# EAGLE design rfid_accessctl (EAGLE 7.5.0)
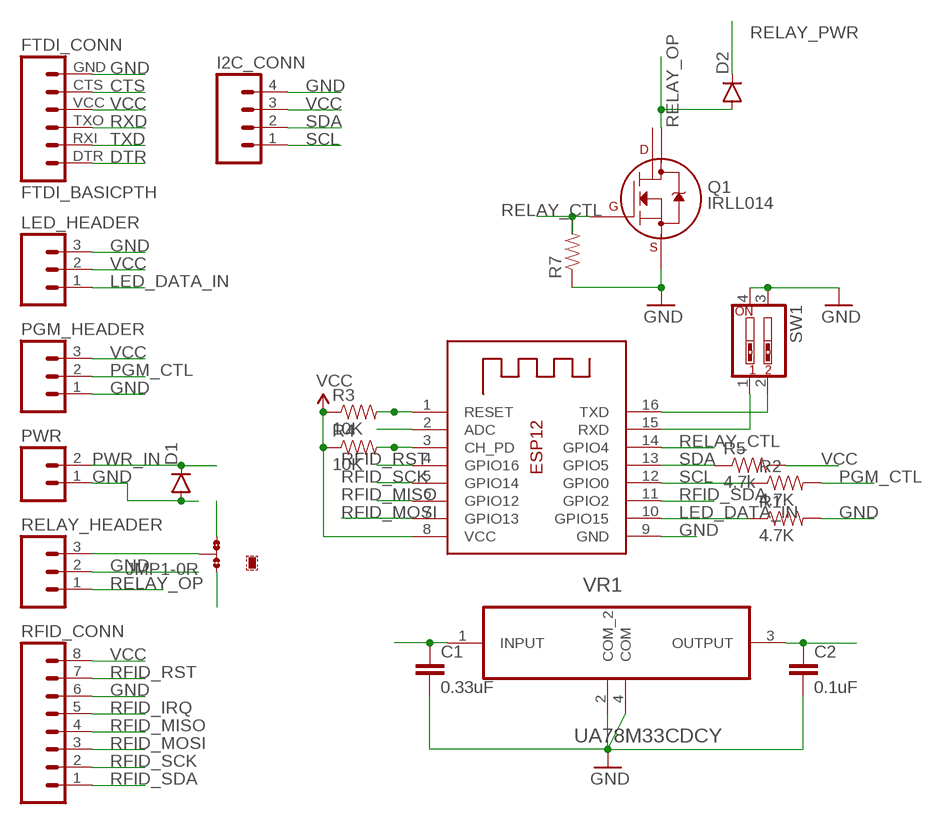
[diagram p0: schematic, sheet 1]

## Parts
C1  0.33uF  CAP0805  [0805]
C2  0.1uF  CAP0805  [0805]
D1  DIODESMA  [SMA-DIODE]
D2  DIODESMA  [SMA-DIODE]
FTDI_CONN  FTDI_BASICPTH  [FTDI_BASIC]
I2C_CONN  M04PTH  [1X04]
JMP1  0R-JUMPB  [B0R-JMP]
LED_HEADER  M03PTH  [1X03]
PGM_HEADER  M03PTH  [1X03]
PWR  M02PTH  [1X02]
Q1  IRLL014  [SOT-223]
R1  4.7K  10KOHM-1/10W-1%(0603)0603  [0603-RES]
R2  4.7K  10KOHM-1/10W-1%(0603)0603  [0603-RES]
R3  10K  10KOHM-1/10W-1%(0603)0603  [0603-RES]
R4  10K  10KOHM-1/10W-1%(0603)0603  [0603-RES]
R5  4.7k  470OHM1/10W1%(0603)  [0603-RES]
R7  RESISTOR0603-RES  [0603-RES]
RELAY_HEADER  M03PTH  [1X03]
RFID_CONN  M08  [1X08_ROUND]
SW1  SW_DIP-2-SMT-HALFSIZE  [DIPSWITCH-02-50MIL]
VR1  UA78M33CDCY  [SOT230P700X180-4N]
X1  ESP-12  [ESP-12]

## Nets
CTS: FTDI_CONN.CTS
DTR: FTDI_CONN.DTR
GND: C1.2 C2.2 D1.A FTDI_CONN.GND I2C_CONN.4 LED_HEADER.3 PGM_HEADER.1 PWR.1 Q1.3(S) R1.2 R7.1 RELAY_HEADER.2 RFID_CONN.6 SW1.3 SW1.4 VR1.2(COM_2) VR1.4(COM) X1.9(GND)
LED_DATA_IN: LED_HEADER.1 R1.1 X1.10(GPIO15)
N$1: R3.2 X1.1(RESET)
N$2: X1.2(ADC)
N$8: R4.2 X1.3(CH_PD)
PGM_CTL: PGM_HEADER.2 R2.2
PWR_IN: C1.1 D1.C JMP1.3 PWR.2 VR1.1(INPUT)
RELAY_CTL: Q1.1(G) R7.2 X1.14(GPIO4)
RELAY_OP: D2.A Q1.2(D1) RELAY_HEADER.1
RELAY_PWR: D2.C JMP1.2 RELAY_HEADER.3
RFID_IRQ: RFID_CONN.5
RFID_MISO: RFID_CONN.4 X1.6(GPIO12)
RFID_MOSI: RFID_CONN.3 X1.7(GPIO13)
RFID_RST: RFID_CONN.7 X1.4(GPIO16)
RFID_SCK: RFID_CONN.2 X1.5(GPIO14)
RFID_SDA: RFID_CONN.1 X1.11(GPIO2)
RXD: FTDI_CONN.TXO SW1.1 X1.15(RXD)
SCL: I2C_CONN.1 R2.1 X1.12(GPIO0)
SDA: I2C_CONN.2 R5.1 X1.13(GPIO5)
TXD: FTDI_CONN.RXI SW1.2 X1.16(TXD)
VCC: C2.1 FTDI_CONN.VCC I2C_CONN.3 JMP1.1 LED_HEADER.2 PGM_HEADER.3 R3.1 R4.1 R5.2 RFID_CONN.8 VR1.3(OUTPUT) X1.8(VCC)
Unconnected: Q1.4(D2)

## Library data of the parts
C1 C2 = SparkFun-Capacitors:CAP: Capacitor Standard 0603 ceramic capacitor, and 0.1" leaded capacitor.
D1 D2 = SparkFun-DiscreteSemi:DIODE: Diode These are standard reverse protection diodes and small signal diodes. SMA package can handle up to about 1A. SOD-323 can handle about 200mA. What the SOD-323 package when ordering, there are some mfgs out there that are 5-pin packages.
FTDI_CONN = SparkFun-Connectors:FTDI_BASIC: FTDI Basic header with labels
I2C_CONN = SparkFun-Connectors:M04: Header 4 Standard 4-pin 0.1" header. Use with straight break away headers (SKU : PRT-00116), right angle break away headers (PRT-00553), swiss pins (PRT-00743), machine pins (PRT-00117), and female headers (PRT-00115). Molex polarized connector foot print use with SKU : PRT-08231 with associated crimp pins and housings. 1MM SMD Version SKU: PRT-10208
JMP1 = jump-0r-smd:0R-JUMP: SMD 0R 0805 Jumper
LED_HEADER PGM_HEADER RELAY_HEADER = SparkFun-Connectors:M03: Header 3 Standard 3-pin 0.1" header. Use with straight break away headers (SKU : PRT-00116), right angle break away headers (PRT-00553), swiss pins (PRT-00743), machine pins (PRT-00117), and female headers (PRT-00115). Molex polarized connector foot print use with SKU : PRT-08232 with associated crimp pins and housings.
PWR = SparkFun-Connectors:M02: Standard 2-pin 0.1" header. Use with - straight break away headers ( PRT-00116) - right angle break away headers (PRT-00553) - swiss pins (PRT-00743) - machine pins (PRT-00117) - female headers (PRT-00115) Molex polarized connector foot print use with: PRT-08233 with associated crimp pins and housings. 2.54_SCREWTERM for use with PRT-10571. 3.5mm Screw Terminal footprints for PRT-08084 5mm Screw Terminal footprints for use with PRT-08432
Q1 = Misc_Transistors:IRLL*: International Rectifier IRLL series N-channel enhancement mode MOSFET HEXFET Power MOSFET SOT-223 Includes body diode
R1 R2 = SparkFun-Resistors:10KOHM-1/10W-1%(0603): RES-00824; PROD_ID: RES-00824; VALUE: 10K
R3 R4 = SparkFun-Resistors:10KOHM-1/10W-1%(0603): RES-00824; PROD_ID: RES-00824
R5 = SparkFun-Resistors:470OHM1/10W1%(0603): RES-07869; PROD_ID: RES-07869; VALUE: 470
R7 = SparkFun-Passives:RESISTOR: Resistor Basic schematic elements and footprints for 0603, 1206, and PTH resistors.
RFID_CONN = SparkFun-Connectors:M08: Header 8 Standard 8-pin 0.1" header. Use with straight break away headers (SKU : PRT-00116), right angle break away headers (PRT-00553), swiss pins (PRT-00743), machine pins (PRT-00117), and female headers (PRT-00115).
SW1 = SparkFun-Electromechanical:SW_DIP-2: DIP SWITCH
VR1 = TI-UA78M33CDCY:UA78M33CDCY: IC, LINEAR VOLT REGULATOR, 3.3V, SOT-223-4; MPN: UA78M33CDCY; OC_FARNELL: 2296031; OC_NEWARK: 03P0895; PACKAGE: SOT-223-4; SUPPLIER: TEXAS INSTRUMENTS
X1 = adafruit:ESP-12

## Board
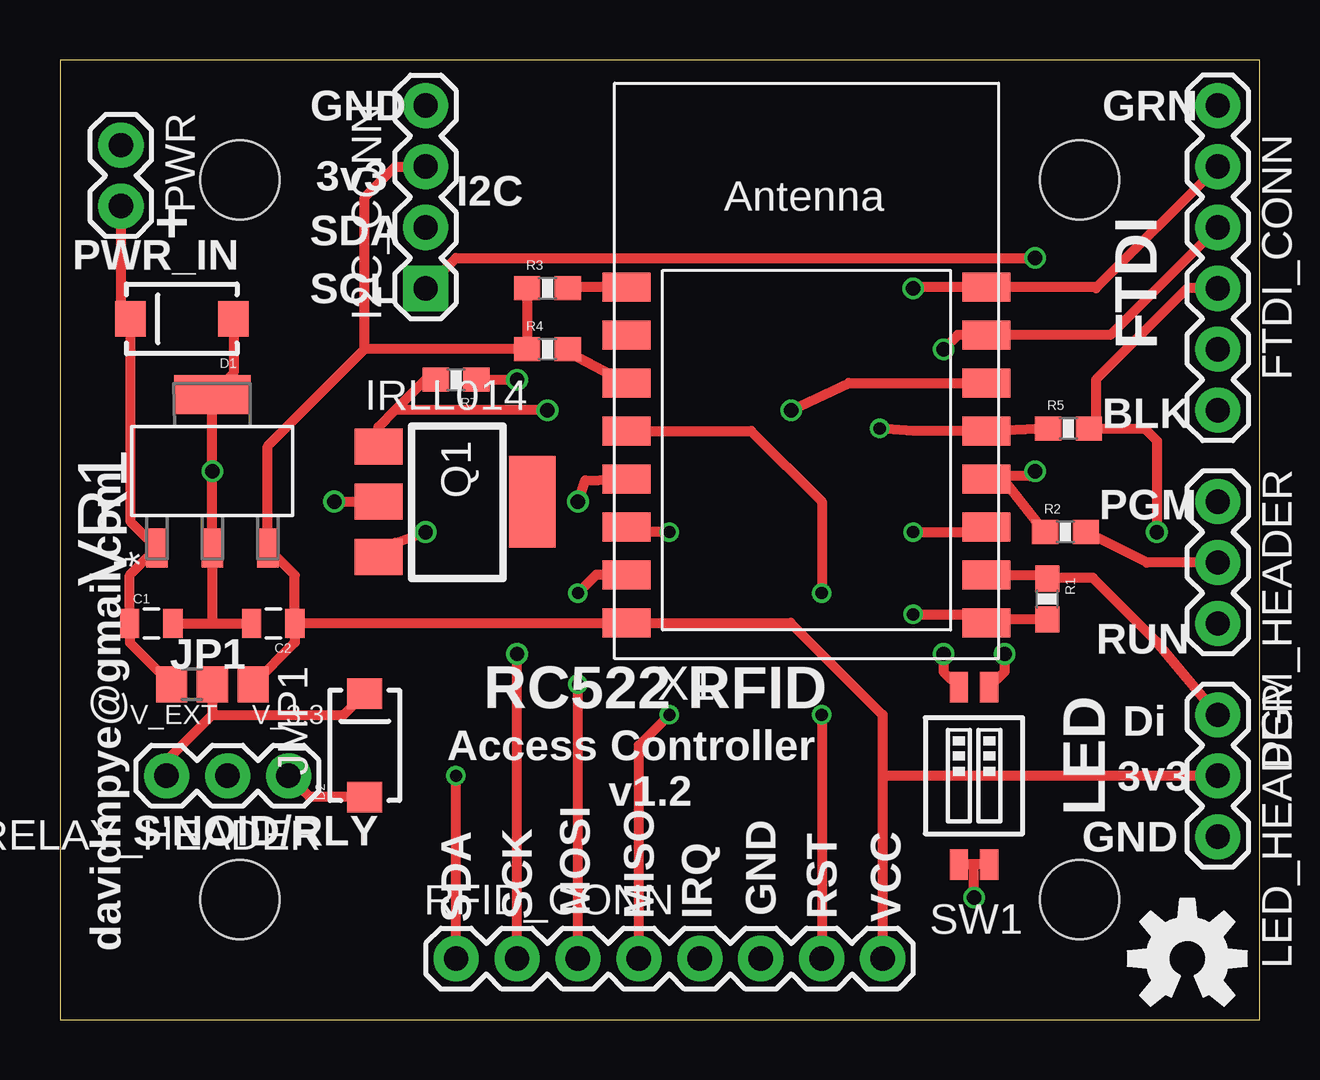
[diagram p1: board, top side]
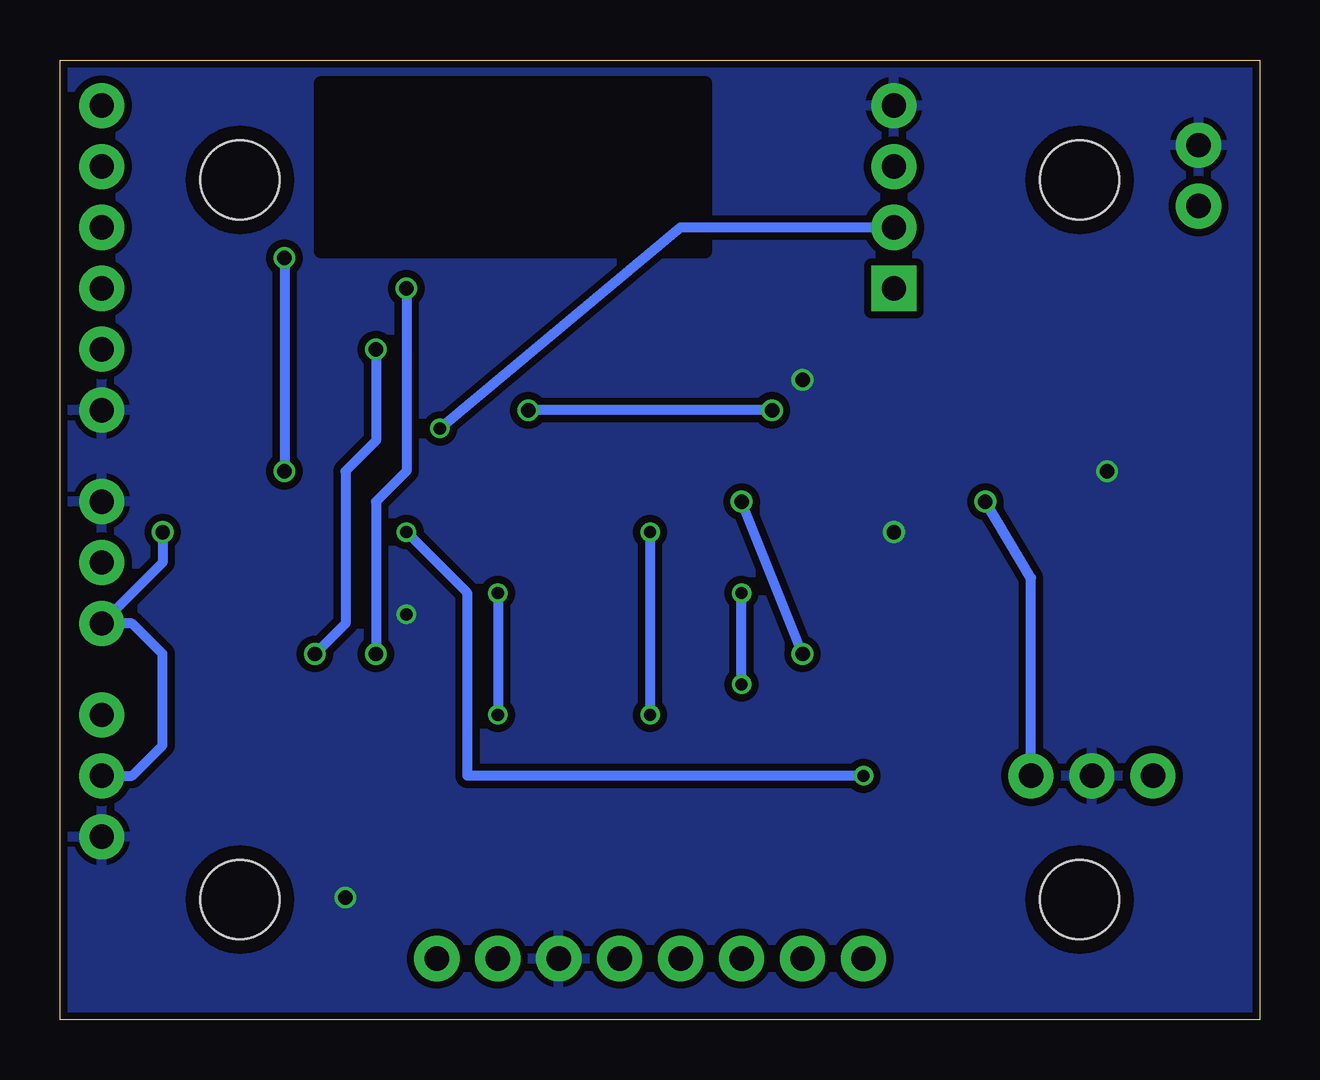
[diagram p2: board, bottom side, seen from below]

Size 50 x 40 mm. Coordinates in mm from the lower left corner, seen from the top.
Outline: 0,0 50,0 50,40 0,40 0,0
Copper layers (1*16): Top 0.035mm / dielectric 1.5mm / Bottom 0.035mm
Design rules "dirt_cheap_dirty_boards.v1": minimum track width 5mil, minimum drill 12mil, track to track 5mil, track to pad 5mil, pad to pad 5mil, via to via 5mil, smd to smd 0mil, copper to edge 10mil, drill to drill 10mil, minimum pad ring 10mil, minimum via ring 6mil, stop-mask expansion 2mil, vias tented up to drill 25mil, thermal gap 10mil

### Footprints (pad centres in the part's own frame; a part is rotated, then mirrored left to right if it is on the bottom)
0805 = smd 0.8 x 1.2: 1 -0.9,0; 2 0.9,0
SMA-DIODE = smd 1.27 x 1.47: A -2.15,0; C 2.15,0
FTDI_BASIC = drill 1.016 pad 1.88: CTS 10.16,0; DTR 0,0; GND 12.7,0; RXI 2.54,0; TXO 5.08,0; VCC 7.62,0
1X04 = drill 1.016 pad 1.88 square: 1 0,0 | drill 1.016 pad 1.88: 2 2.54,0; 3 5.08,0; 4 7.62,0
B0R-JMP = smd 1.5 x 1.3: 1 0,1.7; 2 0,0; 3 0,-1.7
1X03 = drill 1.016 pad 1.88: 1 0,0; 2 2.54,0; 3 5.08,0
1X02 = drill 1.016 pad 1.88: 1 0,0; 2 2.54,0
SOT-223 = smd 1.499 x 2.007: 1 -2.3,-3.235; 2 0,-3.235; 3 2.3,-3.235 | smd 3.81 x 1.93: 4 0,3.175
0603-RES = smd 1.1 x 1: 1 -0.85,0; 2 0.85,0
1X08_ROUND = drill 1.016 pad 1.88: 1 0,0; 2 2.54,0; 3 5.08,0; 4 7.62,0; 5 10.16,0; 6 12.7,0; 7 15.24,0; 8 17.78,0
DIPSWITCH-02-50MIL = smd 0.762 x 1.27: 1 -0.635,-3.7; 2 0.635,-3.7; 3 0.635,3.7; 4 -0.635,3.7
STAND-OFF = hole 3.302: 0,0
SOT230P700X180-4N = smd 1.626 x 0.889: 1 -3.2,2.311; 2 -3.2,0; 3 -3.2,-2.311 | smd 1.626 x 3.175: 4 3.2,0
ESP-12 = smd 2 x 1.2: 1 -7.5,4.5; 2 -7.5,2.5; 3 -7.5,0.5; 4 -7.5,-1.5; 5 -7.5,-3.5; 6 -7.5,-5.5; 7 -7.5,-7.5; 8 -7.5,-9.5; 9 7.5,-9.5; 10 7.5,-7.5; 11 7.5,-5.5; 12 7.5,-3.5; 13 7.5,-1.5; 14 7.5,0.5; 15 7.5,2.5; 16 7.5,4.5

### Placement (x,y rotation side)
C1  3.81,16.51 0 top
C2  8.89,16.51 180 top
D1  5.08,29.21 180 top
D2  12.7,11.43 90 top
FTDI_CONN  48.26,38.1 270 top
I2C_CONN  15.24,30.48 90 top
JMP1  6.35,13.97 270 top
LED_HEADER  48.26,12.7 270 top
PGM_HEADER  48.26,21.59 270 top
PWR  2.54,36.45 270 top
Q1  16.51,21.59 270 top
R1  41.15,17.53 270 top
R2  41.91,20.32 0 top
R3  20.32,30.48 0 top
R4  20.32,27.94 0 top
R5  42.04,24.64 0 top
R7  16.51,26.67 180 top
RELAY_HEADER  9.53,10.16 180 top
RFID_CONN  16.51,2.54 0 top
SW1  38.1,10.16 180 top
U$2  [STAND-OFF]  42.5,5 0 top
U$3  [STAND-OFF]  7.5,5 0 top
U$4  [STAND-OFF]  42.5,35 0 top
U$5  [STAND-OFF]  7.5,35 0 top
U$6  [OSHW-LOGO-M]  46.99,2.54 0 top
VR1  6.35,22.86 90 top
X1  31.11,26.04 0 top

### Tracks (layer width: path | path; a pad name or v marks a point on that pad's centre or on a via)
GND  (via drill 0.51, 0.6)
  Top 0.406: v35.56,16.89 38.1,16.89 | 38.1,16.89 38.26,16.89 X1.9 | R1.2 38.31,16.68 38.1,16.89 | Q1.3 13.97,19.86 v15.24,20.32 | C1.2 6.35,16.51 | 6.35,16.51 C2.2 | 6.35,16.51 VR1.2 v6.35,22.86 VR1.4 7.23,26.94 D1.A | R7.1 v19.05,26.67 | SW1.4 38.1,6.46 | 38.1,6.46 SW1.3 | v38.1,5.08 38.1,6.46
  pour Bottom (isolate 0.305): 0,40 50,40 50,0 0,0
LED_DATA_IN
  Top 0.406: X1.10 40.99,18.54 R1.1 41.19,18.41 43.05,18.41 45.72,15.75 LED_HEADER.1
N$1
  Top 0.406: X1.1 21.23,30.54 R3.2
N$8
  Top 0.406: X1.3 20.94,27.94 R4.2
PGM_CTL
  Top 0.406: PGM_HEADER.2 45.3,19.05 R2.2
PWR_IN
  Top 0.406: JMP1.3 2.91,15.71 C1.1 2.91,18.53 VR1.1 2.93,20.77 D1.C 2.54,29.6 PWR.2
RELAY_CTL  (via drill 0.6)
  Top 0.406: v30.48,25.4 32.88,26.54 X1.14 | v20.32,25.4 13.97,25.4 | 13.97,25.4 13.28,24.7 Q1.1 | R7.2 15.24,26.67 13.97,25.4
  Bottom 0.406: v20.32,25.4 v30.48,25.4
RELAY_OP  (via drill 0.6)
  Top 0.406: v11.43,21.59 Q1.2 | D2.A 10.4,9.28 RELAY_HEADER.1
  Bottom 0.406: RELAY_HEADER.1 9.53,18.41 v11.43,21.59
RELAY_PWR
  Top 0.406: JMP1.2 6.35,12.7 | 6.35,12.7 4.45,10.79 RELAY_HEADER.3 | 6.35,12.7 11.82,12.7 D2.C
RFID_MISO  (via drill 0.51)
  Top 0.406: v25.4,20.32 23.4,20.32 X1.6 | RFID_CONN.4 24.13,11.43 v25.4,12.7
  Bottom 0.406: v25.4,20.32 v25.4,12.7
RFID_MOSI  (via drill 0.51)
  Top 0.406: RFID_CONN.3 v21.59,13.97 | v21.59,17.78 22.34,18.54 X1.7
  Bottom 0.406: v21.59,13.97 v21.59,17.78
RFID_RST  (via drill 0.51)
  Top 0.406: X1.4 28.8,24.54 31.75,21.59 v31.75,17.78 | v31.75,12.7 RFID_CONN.7
  Bottom 0.406: v31.75,17.78 v31.75,12.7
RFID_SCK  (via drill 0.6)
  Top 0.406: RFID_CONN.2 v19.05,15.24 | v21.59,21.59 21.89,22.48 X1.5
  Bottom 0.406: v19.05,15.24 v21.59,21.59
RFID_SDA  (via drill 0.51)
  Top 0.406: RFID_CONN.1 v16.51,10.16 | v35.56,20.32 38.4,20.32 X1.11
  Bottom 0.406: v16.51,10.16 33.02,10.16 33.02,17.78 v35.56,20.32
RXD  (via drill 0.6)
  Top 0.406: FTDI_CONN.TXO 43.77,28.54 X1.15 37.42,28.54 v36.83,27.94 | v39.37,15.24 39.37,14.49 SW1.1
  Bottom 0.406: v36.83,27.94 36.83,24.13 38.1,22.86 38.1,16.51 v39.37,15.24
SCL  (via drill 0.6)
  Top 0.406: R2.1 39.22,22.65 | 39.22,22.65 38.94,22.86 X1.12 | I2C_CONN.1 16.51,31.75 v40.64,31.75 | v40.64,22.86 40.43,22.65 39.22,22.65
  Bottom 0.406: v40.64,31.75 v40.64,22.86
SDA  (via drill 0.51)
  Top 0.406: v34.16,24.64 35.56,24.54 X1.13 38.92,24.54 R5.1
  Bottom 0.406: I2C_CONN.2 24.13,33.02 v34.16,24.64
TXD  (via drill 0.6)
  Top 0.406: FTDI_CONN.RXI 43.18,30.48 43.12,30.54 X1.16 35.62,30.54 v35.56,30.48 | v36.83,15.24 36.83,14.49 SW1.2
  Bottom 0.406: v35.56,30.48 35.56,22.86 36.83,21.59 v36.83,15.24
VCC  (via drill 0.6)
  Top 0.406: R3.1 R4.1 12.7,27.94 | 12.7,27.94 12.7,34.29 13.97,35.56 I2C_CONN.3 | C2.1 23.59,16.51 X1.8 30.45,16.54 34.29,12.7 34.29,10.16 | C2.1 9.79,18.53 VR1.3 8.66,23.9 12.7,27.94 | C2.1 9.79,15.71 JMP1.1 | 34.29,10.16 RFID_CONN.8 | FTDI_CONN.VCC 46.99,30.48 43.18,26.67 43.18,24.93 R5.2 45.21,24.64 45.72,24.13 v45.72,20.32 | LED_HEADER.2 34.29,10.16
  Bottom 0.406: LED_HEADER.2 46.99,10.16 45.72,11.43 45.72,15.24 46.99,16.51 PGM_HEADER.3 45.72,19.05 v45.72,20.32

### Text on the board
tPlace: GND | GRN | 3v3 | I2C | + | SDA | PWR_IN | SCL | FTDI | BLK | davidmpye@gmail.com | PGM | JP1 | RUN | RC522 RFID | Di | V_EXT | V_3.3 | Access Controller | 3v3 | v1.2 | LED | GND | S'NOID/RLY | SDA | SCK | MOSI | MISO | IRQ | GND | RST | VCC